# EAGLE design RecvWeather (EAGLE 8.2.2)
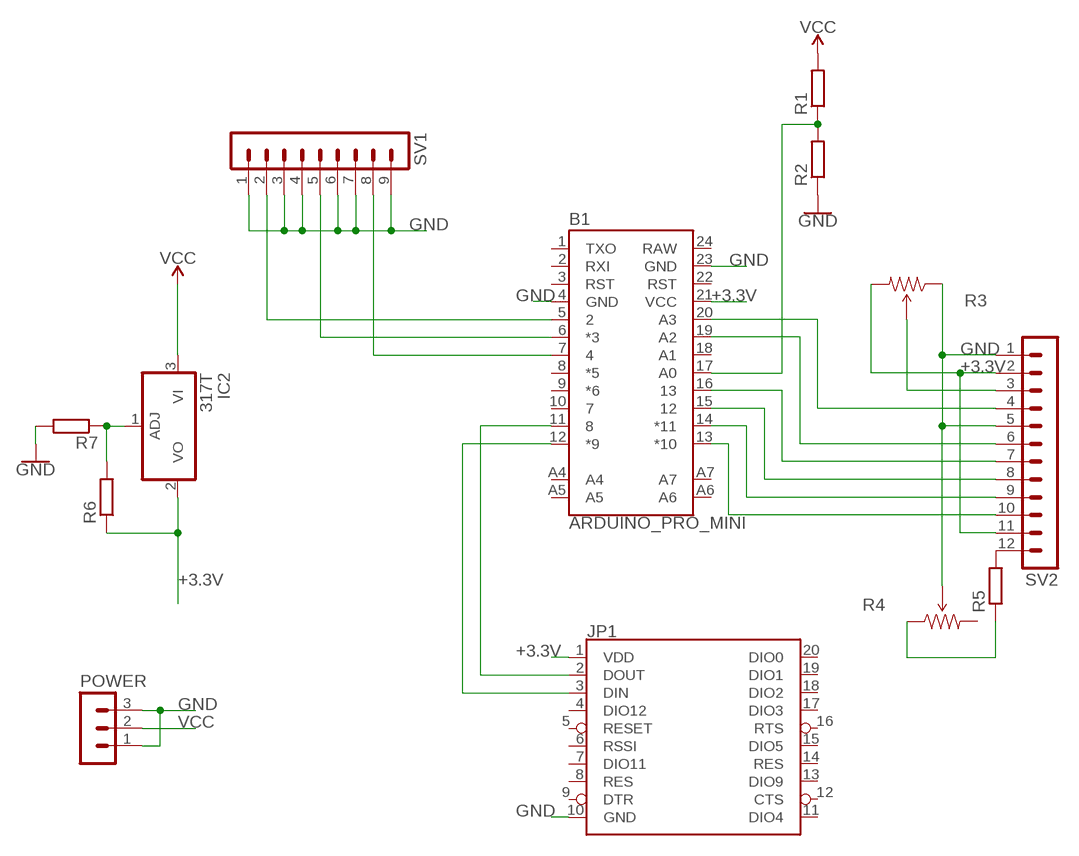
[diagram p0: schematic, sheet 1]

## Parts
B1  ARDUINO_PRO_MINI  [ARDUINO_PRO_MINI]
IC2  317T  [TO220H]
JP1  XBEE  [XBEE]
POWER  MA03-1  [MA03-1]
R1  R-EU_0309/12  [0309/12]
R2  R-EU_0309/12  [0309/12]
R3  TRIMPOTPTH  [TRIM_POT_PTH]
R4  TRIMPOTPTH  [TRIM_POT_PTH]
R5  R-EU_0309/12  [0309/12]
R6  R-EU_0309/12  [0309/12]
R7  R-EU_0309/12  [0309/12]
SV1  MA09-1  [MA09-1]
SV2  MA12-1  [MA12-1]

## Nets
+3.3V: B1.21(VCC) IC2.2(VO) JP1.1(VDD) R3.3(CW) R6.1 SV2.2 SV2.11
GND: B1.4(GND) B1.23(GND) JP1.10(GND) POWER.1 POWER.3 R2.1 R3.1(CCW) R4.2(WIPER) R7.2 SV1.1 SV1.3 SV1.4 SV1.6 SV1.7 SV1.9 SV2.1 SV2.5
N$1: B1.17(A0) R1.1 R2.2
N$2: B1.11 JP1.2(DOUT)
N$3: R5.2 SV2.12
N$4: R4.1(CCW) R5.1
N$5: R3.2(WIPER) SV2.3
N$6: B1.16 SV2.7
N$7: B1.12(*9) JP1.3(DIN)
N$8: B1.20(A3) SV2.4
N$9: B1.19(A2) SV2.6
N$10: B1.5 SV1.2
N$11: B1.6(*3) SV1.5
N$12: B1.7 SV1.8
N$13: IC2.1(ADJ) R6.2 R7.1
N$17: B1.15 SV2.8
N$18: B1.14(*11) SV2.9
N$19: B1.13(*10) SV2.10
VCC: IC2.3(VI) POWER.2 R1.2
Unconnected: B1.1(TXO) B1.2(RXI) B1.3(RST) B1.8(*5) B1.9(*6) B1.10 B1.18(A1) B1.22(RST) B1.A4 B1.A5 B1.A6 B1.A7 JP1.4(DIO12) JP1.5(RESET) JP1.6(RSSI) JP1.7(DIO11) JP1.8(RES) JP1.9(DTR) JP1.11(DIO4) JP1.12(CTS) JP1.13(DIO9) JP1.14(RES) JP1.15(DIO5) JP1.16(RTS) JP1.17(DIO3) JP1.18(DIO2) JP1.19(DIO1) JP1.20(DIO0) R4.3(CW)

## Power pins joined to a net without a drawn wire
RAW: B1.24(RAW)

## Library data of the parts
B1 = SparkFun-arduinonano:ARDUINO_PRO_MINI: SparkFun Pro Mini Pro Mini compatible footprint. Dimensions: 0.7 x 1.3" PCB Thickness: 0.8mm SparkFun Products: 3.3V/8MHz <https://www.sparkfun.com/products/11114> 5V/16MHz <https://www.sparkfun.com/products/11113>
IC2 = linear:*317: Positive VOLTAGE REGULATOR
JP1 = SparkFun-RF:XBEE: Digi XBee and XBee Pro XBees are tiny blue chips that can communicate wirelessly with each other. They can do simple things, like replacing a couple of wires in serial communication, which is nice when you want to make a remote for your paintball vehicle. SparkFun Products SparkFun XBee Buying Guide <https://www.sparkfun.com/pages/xbee_guide> SparkFun XBee Explorer USB <https://www.sparkfun.com/products/11812> (WRL-11812) Breakout Board for XBee Module <https://www.sparkfun.com/products/8276> (WRL-8276) SparkFun XBee Explorer Regulated <https://www.sparkfun.com/products/11373> (WRL-11373) SparkFun XBee Explorer Dongle <https://www.sparkfun.com/products/11697> (WRL-11697) SparkFun XBee Shield <https://www.sparkfun.com/products/12847> (WRL-12847) SparkFun XBee Explorer Serial <https://www.sparkfun.com/products/13225> (WRL-13225)
POWER = con-lstb:MA03-1: PIN HEADER; OC_FARNELL: unknown; OC_NEWARK: unknown
R1 R2 R5-R7 = resistor:R-EU_: RESISTOR, European symbol
R3 R4 = SparkFun-Retired:TRIMPOT: Various small potentiometers for "set-and-forget" applications; PROD_ID: RES-08445
SV1 = con-lstb:MA09-1: PIN HEADER; OC_FARNELL: unknown; OC_NEWARK: unknown
SV2 = con-lstb:MA12-1: PIN HEADER; OC_FARNELL: unknown; OC_NEWARK: unknown

## Board
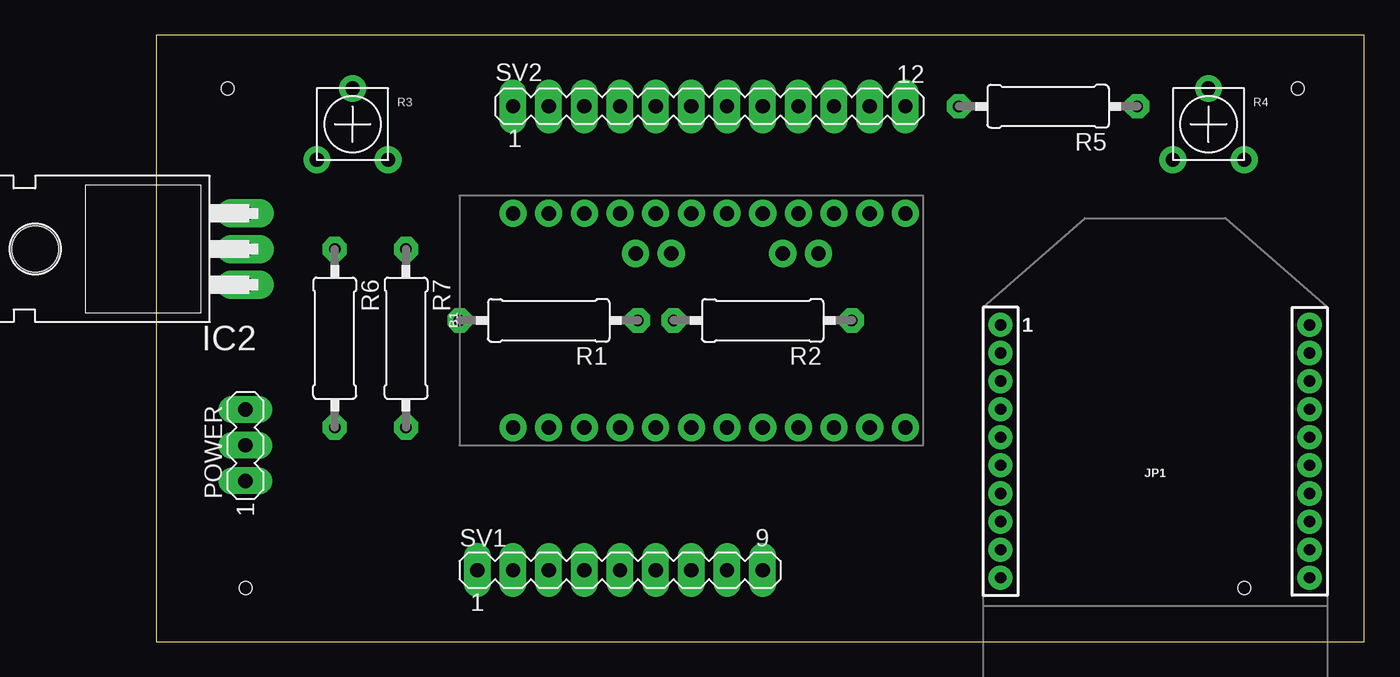
[diagram p1: board, top side]
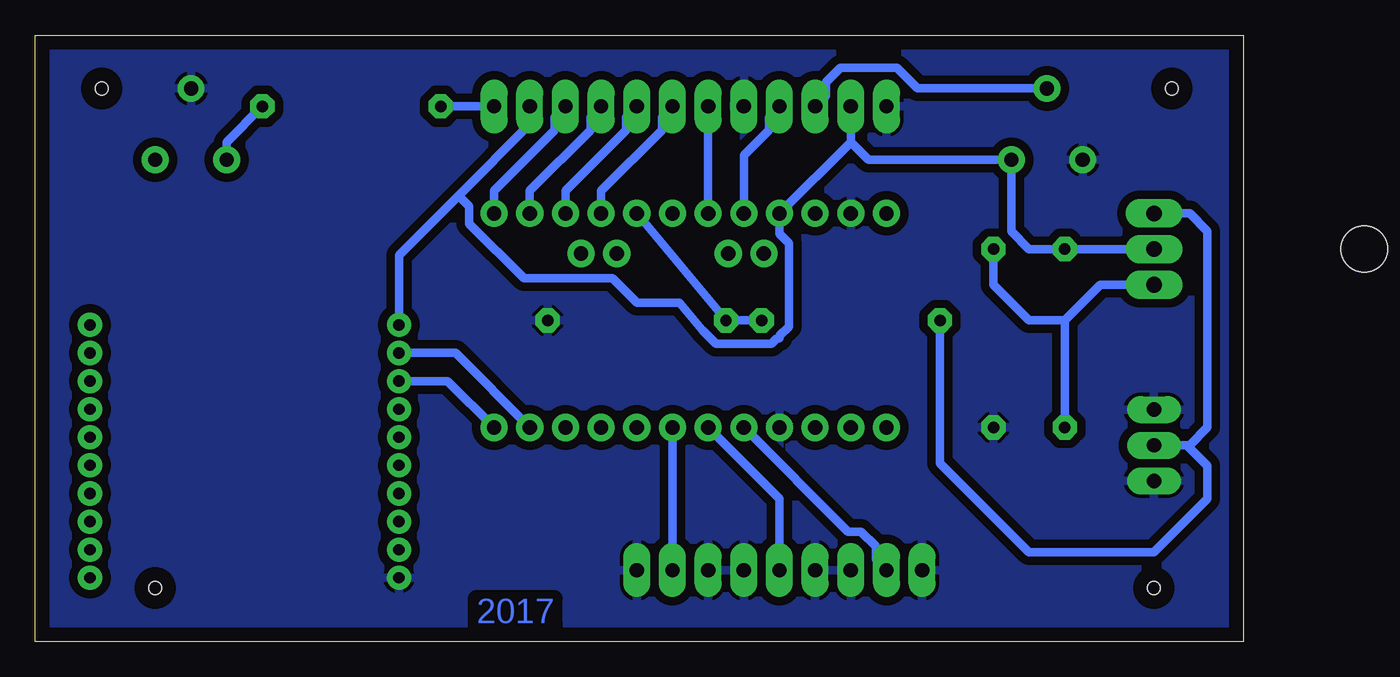
[diagram p2: board, bottom side, seen from below]

Size 86.03 x 43.17 mm. Coordinates in mm from the lower left corner, seen from the top.
Outline: 0,0 86.03,0 86.03,43.17 0,43.17 0,0
Copper layers (1*16): Top 0.035mm / dielectric 1.5mm / Bottom 0.035mm
Design rules "default *": minimum track width 6mil, minimum drill 0.35mm, track to track 20mil, track to pad 20mil, pad to pad 6mil, via to via 6mil, smd to smd 6mil, copper to edge 40mil, drill to drill 6mil, minimum pad ring 18mil, minimum via ring 8mil, stop-mask expansion 4mil, vias tented up to drill 0mil, thermal gap 10mil
Holes 0.9 mm at 5.08,39.37 81.28,39.37 77.47,3.81 6.35,3.81

### Footprints (pad centres in the part's own frame; a part is rotated, then mirrored left to right if it is on the bottom)
ARDUINO_PRO_MINI = drill 1.016 pad 1.88: 1 -7.62,12.7; 2 -7.62,10.16; 3 -7.62,7.62; 4 -7.62,5.08; 5 -7.62,2.54; 6 -7.62,0; 7 -7.62,-2.54; 8 -7.62,-5.08; 9 -7.62,-7.62; 10 -7.62,-10.16; 11 -7.62,-12.7; 12 -7.62,-15.24; 13 7.62,-15.24; 14 7.62,-12.7; 15 7.62,-10.16; 16 7.62,-7.62; 17 7.62,-5.08; 18 7.62,-2.54; 19 7.62,0; 20 7.62,2.54; 21 7.62,5.08; 22 7.62,7.62; 23 7.62,10.16; 24 7.62,12.7; A4 4.763,1.429; A5 4.763,3.969; A6 4.763,-9.049; A7 4.763,-6.509
TO220H = drill 1.118 long: 1 -2.54,-10.16; 2 0,-10.16; 3 2.54,-10.16 | hole 3.302: 0,4.826
XBEE = drill 0.8 pad 1.524: 1 -11,20; 2 -11,18; 3 -11,16; 4 -11,14; 5 -11,12; 6 -11,10; 7 -11,8; 8 -11,6; 9 -11,4; 10 -11,2; 11 11,2; 12 11,4; 13 11,6; 14 11,8; 15 11,10; 16 11,12; 17 11,14; 18 11,16; 19 11,18; 20 11,20
MA03-1 = drill 1.016 long: 1 -2.54,0; 2 0,0; 3 2.54,0
0309/12 = drill 0.813 octagon: 1 -6.35,0; 2 6.35,0
TRIM_POT_PTH = drill 1 pad 1.88: 1 -2.54,-2.54; 2 0,2.54; 3 2.54,-2.54
MA09-1 = drill 1.016 long: 1 -10.16,0; 2 -7.62,0; 3 -5.08,0; 4 -2.54,0; 5 0,0; 6 2.54,0; 7 5.08,0; 8 7.62,0; 9 10.16,0
MA12-1 = drill 1.016 long: 1 -13.97,0; 2 -11.43,0; 3 -8.89,0; 4 -6.35,0; 5 -3.81,0; 6 -1.27,0; 7 1.27,0; 8 3.81,0; 9 6.35,0; 10 8.89,0; 11 11.43,0; 12 13.97,0

### Placement (x,y rotation side)
B1  38.1,22.86 90 top
IC2  -3.81,27.94 90 top
JP1  71.12,2.54 0 top
POWER  6.35,13.97 90 top
R1  27.94,22.86 180 top
R2  43.18,22.86 180 top
R3  13.97,36.83 0 top
R4  74.93,36.83 0 top
R5  63.5,38.1 180 top
R6  12.7,21.59 270 top
R7  17.78,21.59 270 top
SV1  33.02,5.08 0 top
SV2  39.37,38.1 0 top

### Tracks (layer width: path | path; a pad name or v marks a point on that pad's centre or on a via)
+3.3V
  Bottom 0.61: JP1.1 60.12,27.51 55.88,31.75 | 55.88,31.75 50.8,36.83 SV2.11 | 27.94,35.56 26.67,34.29 R3.3 16.51,29.21 15.24,27.94 R6.1 IC2.2 | 27.94,35.56 SV2.2 | 27.94,35.56 B1.21 33.02,29.03 32.35,28.36 32.35,22.43 33.02,21.76 33.02,21.59 33.19,21.59 33.6,21.18 37.52,21.18 38.51,22.17 40.14,24.13 43.18,24.13 44.9,25.84 51.22,25.84 55.12,29.74 55.12,30.99 55.88,31.75
GND
  pour Bottom (isolate 0.61): 0,43.18 86.36,43.18 86.36,0 0,0
N$1
  Bottom 0.61: R1.1 R2.2 B1.17
N$2
  Bottom 0.61: JP1.2 56.1,20.54 B1.11
N$3
  Bottom 0.61: R5.2 SV2.12
N$4
  Bottom 0.61: R4.1 72.39,35.56 R5.1
N$5
  Bottom 0.61: SV2.3 29.72,38.86 29.72,39.8 28.68,40.84 24.66,40.84 23.19,39.37 R3.2
N$6
  Bottom 0.61: SV2.7 41.4,37.34 41.4,36.4 45.72,32.08 B1.16
N$7
  Bottom 0.61: JP1.3 56.64,18.54 B1.12
N$8
  Bottom 0.61: SV2.4 33.78,37.34 33.78,36.4 35.56,34.62 B1.20
N$9
  Bottom 0.61: B1.19 SV2.6
N$10
  Bottom 0.61: SV1.2 26.16,5.84 26.16,6.78 27.2,7.82 28.14,7.82 B1.5
N$11
  Bottom 0.61: SV1.5 33.02,10.16 B1.6
N$12
  Bottom 0.61: SV1.8 B1.7
N$13
  Bottom 0.61: 12.7,22.84 R6.2 | 12.7,22.84 12.7,22.86 10.16,25.4 IC2.1 | R7.1 17.78,25.4 15.24,22.86 12.72,22.86 12.7,22.84
N$17
  Bottom 0.61: SV2.8 43.94,37.34 43.94,36.4 48.26,32.08 B1.15
N$18
  Bottom 0.61: SV2.9 46.48,37.34 46.48,36.4 50.8,32.08 B1.14
N$19
  Bottom 0.61: SV2.10 49.02,37.34 49.02,36.4 53.34,32.08 B1.13
VCC
  Bottom 0.61: IC2.3 3.81,30.48 2.54,29.21 2.54,15.24 3.81,13.97 4,13.97 | 4,13.97 POWER.2 | R1.2 21.59,12.7 15.24,6.35 6.35,6.35 2.54,10.16 2.54,12.51 4,13.97

### Text on the board
Bottom: 2017